# Altium schematic sheet schematic.SchDoc
size A2; SheetNumber: 6; SheetTotal: 29
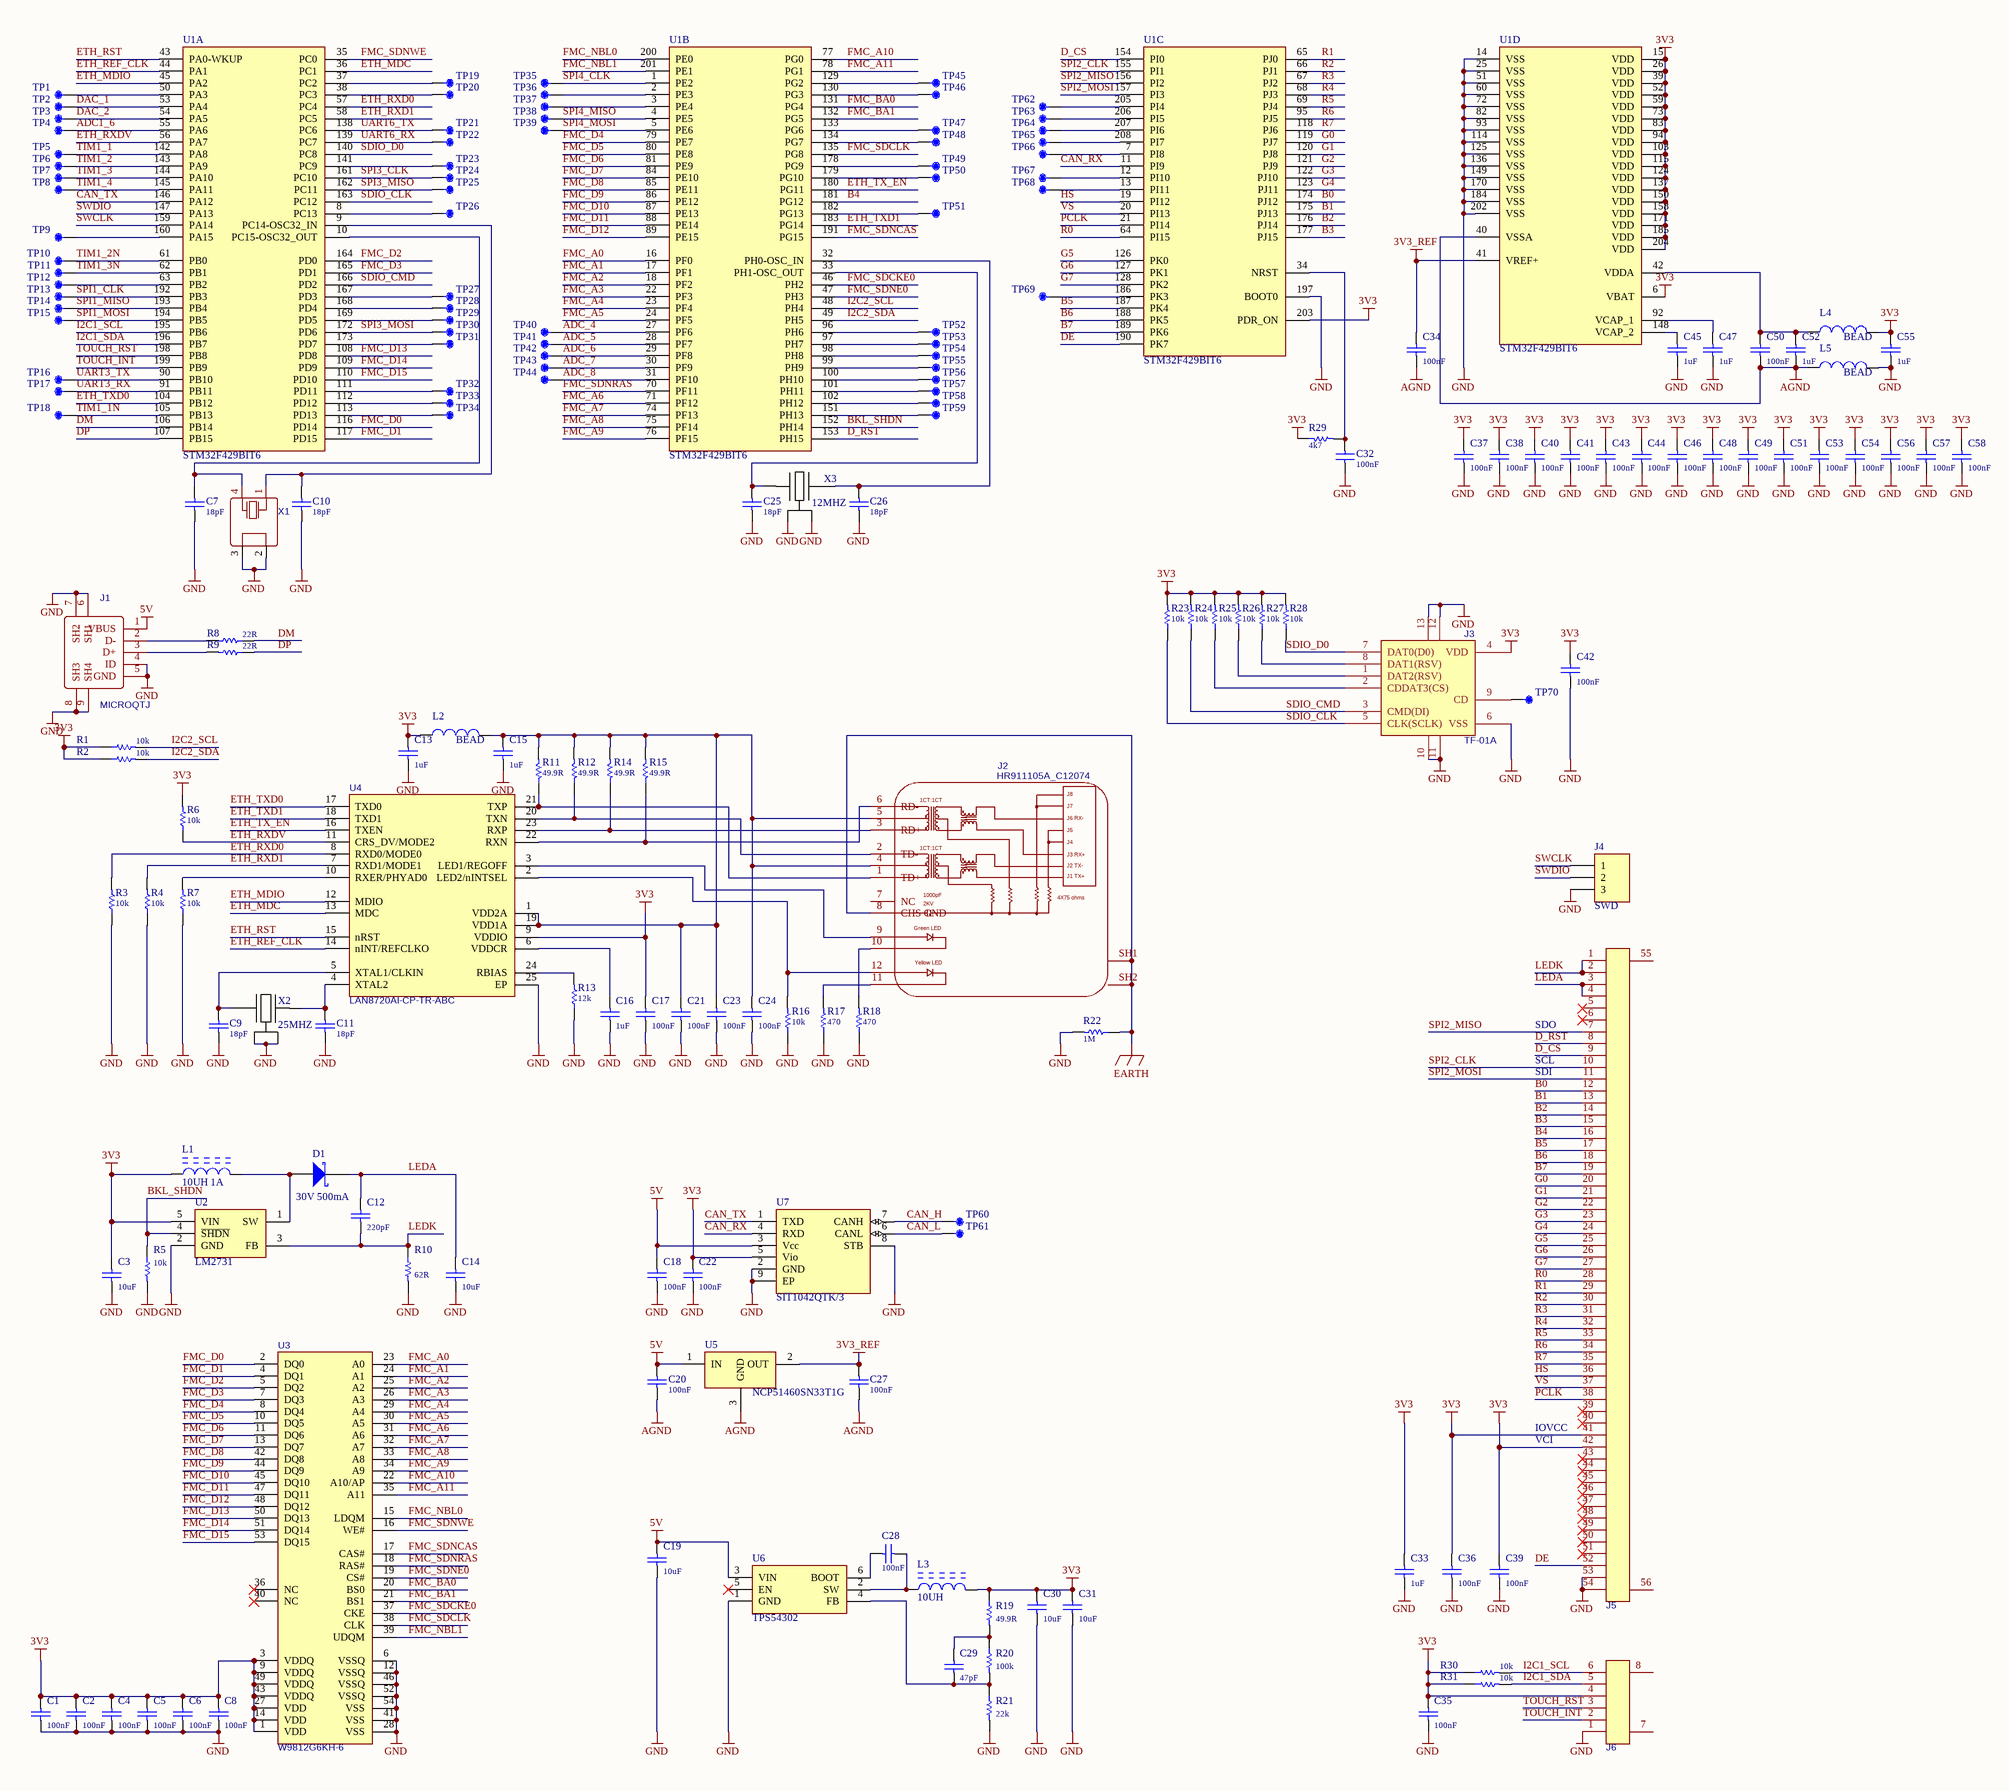
[diagram p0: schematic.SchDoc]

## Parts
C1  100nF  [C0402]
C2  100nF  [C0402]
C3  10uF  [C0603]
C4  100nF  [C0402]
C5  100nF  [C0402]
C6  100nF  [C0402]
C7  18pF  [C0402]
C8  100nF  [C0402]
C9  18pF  [C0402]
C10  18pF  [C0402]
C11  18pF  [C0402]
C12  220pF  [C0402]
C13  1uF  [C0603]
C14  10uF  [C1206]
C15  1uF  [C0603]
C16  1uF  [C0603]
C17  100nF  [C0402]
C18  100nF  [C0402]
C19  10uF  [C1206]
C20  100nF  [C0603]
C21  100nF  [C0402]
C22  100nF  [C0402]
C23  100nF  [C0402]
C24  100nF  [C0402]
C25  18pF  [C0402]
C26  18pF  [C0402]
C27  100nF  [C0603]
C28  100nF  [C0603]
C29  47pF  [C0603]
C30  10uF  [C1206]
C31  10uF  [C1206]
C32  100nF  [C0402]
C33  1uF  [C0603]
C34  100nF  [C0402]
C35  100nF  [C0402]
C36  100nF  [C0402]
C37  100nF  [C0402]
C38  100nF  [C0402]
C39  100nF  [C0402]
C40  100nF  [C0402]
C41  100nF  [C0402]
C42  100nF  [C0402]
C43  100nF  [C0402]
C44  100nF  [C0402]
C45  1uF  [C0603]
C46  100nF  [C0402]
C47  1uF  [C0603]
C48  100nF  [C0402]
C49  100nF  [C0402]
C50  100nF  [C0402]
C51  100nF  [C0402]
C52  1uF  [C0603]
C53  100nF  [C0402]
C54  100nF  [C0402]
C55  1uF  [C0603]
C56  100nF  [C0402]
C57  100nF  [C0402]
C58  100nF  [C0402]
D1  30V 500mA  [SOD123]
J1  MICROQTJ  [MICRO-USB-SMD_MICROQTJ]
J2  HR911105A_C12074  [RJ45-TH_HR911105A]
J3  TF-01A  [TF-SMD_TF-01A]
J4  SWD  [SWD]  (no BOM)
J5  KH-CL0.5-H2.0-54PIN  [FPC-SMD_KH-CL0.5-H2.0-54PIN]  (value not drawn)
J6  KH-CL0.5-H2.0-6PS  [FPC-SMD_KH-CL0.5-H2.0-6PS]  (value not drawn)
L1  10UH 1A  [IND_SDE0403A_4X4MM]
L2  BEAD  [L0603]
L3  10UH  [L2520]
L4  BEAD  [L0402]
L5  BEAD  [L0402]
R1  10k  [R0603]
R2  10k  [R0603]
R3  10k  [R0402]
R4  10k  [R0402]
R5  10k  [R0402]
R6  10k  [R0402]
R7  10k  [R0402]
R8  22R  [R0603]
R9  22R  [R0603]
R10  62R  [R0603]
R11  49.9R  [R0603]
R12  49.9R  [R0603]
R13  12k  [R0402]
R14  49.9R  [R0603]
R15  49.9R  [R0603]
R16  10k  [R0603]
R17  470  [R0603]
R18  470  [R0603]
R19  49.9R  [R0603]
R20  100k  [R0603]
R21  22k  [R0603]
R22  1M  [R1206]
R23  10k  [R0603]
R24  10k  [R0603]
R25  10k  [R0603]
R26  10k  [R0603]
R27  10k  [R0603]
R28  10k  [R0603]
R29  4k7  [R0402]
R30  10k  [R0603]
R31  10k  [R0603]
TP1  (no value)  [TP2030_SMD]  (no BOM)
TP2  (no value)  [TP2030_SMD]  (no BOM)
TP3  (no value)  [TP2030_SMD]  (no BOM)
TP4  (no value)  [TP2030_SMD]  (no BOM)
TP5  (no value)  [TP2030_SMD]  (no BOM)
TP6  (no value)  [TP2030_SMD]  (no BOM)
TP7  (no value)  [TP2030_SMD]  (no BOM)
TP8  (no value)  [TP2030_SMD]  (no BOM)
TP9  (no value)  [TP2030_SMD]  (no BOM)
TP10  (no value)  [TP2030_SMD]  (no BOM)
TP11  (no value)  [TP2030_SMD]  (no BOM)
TP12  (no value)  [TP2030_SMD]  (no BOM)
TP13  (no value)  [TP2030_SMD]  (no BOM)
TP14  (no value)  [TP2030_SMD]  (no BOM)
TP15  (no value)  [TP2030_SMD]  (no BOM)
TP16  (no value)  [TP2030_SMD]  (no BOM)
TP17  (no value)  [TP2030_SMD]  (no BOM)
TP18  (no value)  [TP2030_SMD]  (no BOM)
TP19  (no value)  [TP2030_SMD]  (no BOM)
TP20  (no value)  [TP2030_SMD]  (no BOM)
TP21  (no value)  [TP2030_SMD]  (no BOM)
TP22  (no value)  [TP2030_SMD]  (no BOM)
TP23  (no value)  [TP2030_SMD]  (no BOM)
TP24  (no value)  [TP2030_SMD]  (no BOM)
TP25  (no value)  [TP2030_SMD]  (no BOM)
TP26  (no value)  [TP2030_SMD]  (no BOM)
TP27  (no value)  [TP2030_SMD]  (no BOM)
TP28  (no value)  [TP2030_SMD]  (no BOM)
TP29  (no value)  [TP2030_SMD]  (no BOM)
TP30  (no value)  [TP2030_SMD]  (no BOM)
TP31  (no value)  [TP2030_SMD]  (no BOM)
TP32  (no value)  [TP2030_SMD]  (no BOM)
TP33  (no value)  [TP2030_SMD]  (no BOM)
TP34  (no value)  [TP2030_SMD]  (no BOM)
TP35  (no value)  [TP2030_SMD]  (no BOM)
TP36  (no value)  [TP2030_SMD]  (no BOM)
TP37  (no value)  [TP2030_SMD]  (no BOM)
TP38  (no value)  [TP2030_SMD]  (no BOM)
TP39  (no value)  [TP2030_SMD]  (no BOM)
TP40  (no value)  [TP2030_SMD]  (no BOM)
TP41  (no value)  [TP2030_SMD]  (no BOM)
TP42  (no value)  [TP2030_SMD]  (no BOM)
TP43  (no value)  [TP2030_SMD]  (no BOM)
TP44  (no value)  [TP2030_SMD]  (no BOM)
TP45  (no value)  [TP2030_SMD]  (no BOM)
TP46  (no value)  [TP2030_SMD]  (no BOM)
TP47  (no value)  [TP2030_SMD]  (no BOM)
TP48  (no value)  [TP2030_SMD]  (no BOM)
TP49  (no value)  [TP2030_SMD]  (no BOM)
TP50  (no value)  [TP2030_SMD]  (no BOM)
TP51  (no value)  [TP2030_SMD]  (no BOM)
TP52  (no value)  [TP2030_SMD]  (no BOM)
TP53  (no value)  [TP2030_SMD]  (no BOM)
TP54  (no value)  [TP2030_SMD]  (no BOM)
TP55  (no value)  [TP2030_SMD]  (no BOM)
TP56  (no value)  [TP2030_SMD]  (no BOM)
TP57  (no value)  [TP2030_SMD]  (no BOM)
TP58  (no value)  [TP2030_SMD]  (no BOM)
TP59  (no value)  [TP2030_SMD]  (no BOM)
TP60  (no value)  [TP2030_SMD]  (no BOM)
TP61  (no value)  [TP2030_SMD]  (no BOM)
TP62  (no value)  [TP2030_SMD]  (no BOM)
TP63  (no value)  [TP2030_SMD]  (no BOM)
TP64  (no value)  [TP2030_SMD]  (no BOM)
TP65  (no value)  [TP2030_SMD]  (no BOM)
TP66  (no value)  [TP2030_SMD]  (no BOM)
TP67  (no value)  [TP2030_SMD]  (no BOM)
TP68  (no value)  [TP2030_SMD]  (no BOM)
TP69  (no value)  [TP2030_SMD]  (no BOM)
TP70  (no value)  [TP2030_SMD]  (no BOM)
U1  STM32F429BIT6  [LQFP-208_L28.0-W28.0-P0.50-BL]  (parts A,B,C,D of 4)
U2  LM2731  [SOT-23-5]
U3  W9812G6KH-6  [TSOP-54_L22.2-W10.2-P0.80-LS11.8-BL]
U4  LAN8720AI-CP-TR-ABC  [QFN-24_L4.0-W4.0-P0.50-TL-EP2.5]
U5  NCP51460SN33T1G  [SOT-23]
U6  TPS54302  [SOT-23-6]
U7  SIT1042QTK/3  [DFN8_3X3_P065]
X1  32.768kHz  [MC-146]  (value not drawn)
X2  25MHZ  [CRYSTAL_3.2x2.5mm]
X3  12MHZ  [CRYSTAL_3.2x2.5mm]

## Nets
3V3: C1.2 C2.2 C3.2 C4.2 C5.2 C6.2 C8.2 C13.2 C17.2 C22.2 C30.2 C31.2 C33.2 C35.2 C36.2 C37.2 C38.2 C39.2 C40.2 C41.2 C42.2 C43.2 C44.2 C46.2 C48.2 C49.2 C51.2 C53.2 C54.2 C55.2 C56.2 C57.2 C58.2 J3.4(VDD) J5.41 J5.42 J6.4 L1.1 L2.2 L3.2 L4.1 R1.1 R2.1 R6.2 R19.1 R23.2 R24.2 R25.2 R26.2 R27.2 R28.2 R29.1 R30.1 R31.1 U1.6(VBAT) U1.15(VDD) U1.26(VDD) U1.39(VDD) U1.52(VDD) U1.59(VDD) U1.73(VDD) U1.83(VDD) U1.94(VDD) U1.103(VDD) U1.115(VDD) U1.124(VDD) U1.137(VDD) U1.150(VDD) U1.158(VDD) U1.171(VDD) U1.185(VDD) U1.203(PDR_ON) U1.204(VDD) U2.5(VIN) U3.1(VDD) U3.3(VDDQ) U3.9(VDDQ) U3.14(VDD) U3.27(VDD) U3.43(VDDQ) U3.49(VDDQ) U4.9(VDDIO) U7.5(Vio)
3V3_REF: C27.2 C34.2 U1.41(VREF+) U5.2(OUT)
5V: C18.2 C19.2 C20.2 J1.1(VBUS) U5.1(IN) U6.3(VIN) U7.3(Vcc)
AGND: C20.1 C27.1 C34.1 C50.1 C52.1 L5.2 U1.40(VSSA) U5.3(GND)
EARTH: J2.8(CHS_GND) J2.SH1 J2.SH2 R22.1
GND: C1.1 C2.1 C3.1 C4.1 C5.1 C6.1 C7.1 C8.1 C9.1 C10.1 C11.1 C13.1 C14.1 C15.1 C16.1 C17.1 C18.1 C19.1 C21.1 C22.1 C23.1 C24.1 C25.1 C26.1 C30.1 C31.1 C32.1 C33.1 C35.1 C36.1 C37.1 C38.1 C39.1 C40.1 C41.1 C42.1 C43.1 C44.1 C45.1 C46.1 C47.1 C48.1 C49.1 C51.1 C53.1 C54.1 C55.1 C56.1 C57.1 C58.1 J1.4(ID) J1.5(GND) J1.6(SH1) J1.7(SH2) J1.8(SH3) J1.9(SH4) J3.6(VSS) J3.10(GND) J3.11(GND) J3.12(GND) J3.13(GND) J4.3 J5.53 J5.54 J6.1 L5.1 R3.1 R4.1 R5.2 R7.1 R10.2 R13.1 R16.1 R17.1 R18.1 R21.2 R22.2 U1.14(VSS) U1.25(VSS) U1.51(VSS) U1.60(VSS) U1.72(VSS) U1.82(VSS) U1.93(VSS) U1.114(VSS) U1.125(VSS) U1.136(VSS) U1.149(VSS) U1.170(VSS) U1.184(VSS) U1.197(BOOT0) U1.202(VSS) U2.2(GND) U3.6(VSSQ) U3.12(VSSQ) U3.28(VSS) U3.41(VSS) U3.46(VSSQ) U3.52(VSSQ) U3.54(VSS) U4.25(EP) U6.1(GND) U7.2(GND) U7.8(STB) U7.9(EP) X1.2 X1.3 X2.2(GND) X2.4(GND) X3.2(GND) X3.4(GND)
ADC1_6: TP4.1 U1.55(PA6)
ADC_4: TP40.1 U1.27(PF6)
ADC_5: TP41.1 U1.28(PF7)
ADC_6: TP42.1 U1.29(PF8)
ADC_7: TP43.1 U1.30(PF9)
ADC_8: TP44.1 U1.31(PF10)
B0: J5.12 U1.174(PJ12)
B1: J5.13 U1.175(PJ13)
B2: J5.14 U1.176(PJ14)
B3: J5.15 U1.177(PJ15)
B4: J5.16 U1.181(PG12)
B5: J5.17 U1.187(PK4)
B6: J5.18 U1.188(PK5)
B7: J5.19 U1.189(PK6)
BKL_SHDN: R5.1 U1.152(PH14) U2.4(~{SHDN})
CAN_H: TP60.1 U7.7(CANH)
CAN_L: TP61.1 U7.6(CANL)
CAN_RX: U1.11(PI9) U7.4(RXD)
CAN_TX: U1.146(PA12) U7.1(TXD)
D_CS: J5.9 U1.154(PI0)
D_RST: J5.8 U1.153(PH15)
DAC_1: TP2.1 U1.53(PA4)
DAC_2: TP3.1 U1.54(PA5)
DE: J5.52 U1.190(PK7)
DM: R8.1 U1.106(PB14)
DP: R9.1 U1.107(PB15)
ETH_MDC: U1.36(PC1) U4.13(MDC)
ETH_MDIO: U1.45(PA2) U4.12(MDIO)
ETH_REF_CLK: U1.44(PA1) U4.14(nINT/REFCLKO)
ETH_RST: U1.43(PA0-WKUP) U4.15(nRST)
ETH_RXD0: R3.2 U1.57(PC4) U4.8(RXD0/MODE0)
ETH_RXD1: R4.2 U1.58(PC5) U4.7(RXD1/MODE1)
ETH_RXDV: R6.1 U1.56(PA7) U4.11(CRS_DV/MODE2)
ETH_TX_EN: U1.180(PG11) U4.16(TXEN)
ETH_TXD0: U1.104(PB12) U4.17(TXD0)
ETH_TXD1: U1.183(PG14) U4.18(TXD1)
FMC_A0: U1.16(PF0) U3.23(A0)
FMC_A1: U1.17(PF1) U3.24(A1)
FMC_A2: U1.18(PF2) U3.25(A2)
FMC_A3: U1.22(PF3) U3.26(A3)
FMC_A4: U1.23(PF4) U3.29(A4)
FMC_A5: U1.24(PF5) U3.30(A5)
FMC_A6: U1.71(PF12) U3.31(A6)
FMC_A7: U1.74(PF13) U3.32(A7)
FMC_A8: U1.75(PF14) U3.33(A8)
FMC_A9: U1.76(PF15) U3.34(A9)
FMC_A10: U1.77(PG0) U3.22(A10/AP)
FMC_A11: U1.78(PG1) U3.35(A11)
FMC_BA0: U1.131(PG4) U3.20(BS0)
FMC_BA1: U1.132(PG5) U3.21(BS1)
FMC_D0: U1.116(PD14) U3.2(DQ0)
FMC_D1: U1.117(PD15) U3.4(DQ1)
FMC_D2: U1.164(PD0) U3.5(DQ2)
FMC_D3: U1.165(PD1) U3.7(DQ3)
FMC_D4: U1.79(PE7) U3.8(DQ4)
FMC_D5: U1.80(PE8) U3.10(DQ5)
FMC_D6: U1.81(PE9) U3.11(DQ6)
FMC_D7: U1.84(PE10) U3.13(DQ7)
FMC_D8: U1.85(PE11) U3.42(DQ8)
FMC_D9: U1.86(PE12) U3.44(DQ9)
FMC_D10: U1.87(PE13) U3.45(DQ10)
FMC_D11: U1.88(PE14) U3.47(DQ11)
FMC_D12: U1.89(PE15) U3.48(DQ12)
FMC_D13: U1.108(PD8) U3.50(DQ13)
FMC_D14: U1.109(PD9) U3.51(DQ14)
FMC_D15: U1.110(PD10) U3.53(DQ15)
FMC_NBL0: U1.200(PE0) U3.15(LDQM)
FMC_NBL1: U1.201(PE1) U3.39(UDQM)
FMC_SDCKE0: U1.46(PH2) U3.37(CKE)
FMC_SDCLK: U1.135(PG8) U3.38(CLK)
FMC_SDNCAS: U1.191(PG15) U3.17(CAS#)
FMC_SDNE0: U1.47(PH3) U3.19(CS#)
FMC_SDNRAS: U1.70(PF11) U3.18(RAS#)
FMC_SDNWE: U1.35(PC0) U3.16(WE#)
G0: J5.20 U1.119(PJ7)
G1: J5.21 U1.120(PJ8)
G2: J5.22 U1.121(PJ9)
G3: J5.23 U1.122(PJ10)
G4: J5.24 U1.123(PJ11)
G5: J5.25 U1.126(PK0)
G6: J5.26 U1.127(PK1)
G7: J5.27 U1.128(PK2)
HS: J5.36 U1.19(PI12)
I2C1_SCL: J6.6 R30.2 U1.195(PB6)
I2C1_SDA: J6.5 R31.2 U1.196(PB7)
I2C2_SCL: R1.2 U1.48(PH4)
I2C2_SDA: R2.2 U1.49(PH5)
LEDA: C12.2 C14.2 D1.2(K) J5.3 J5.4
LEDK: C12.1 J5.1 J5.2 R10.1 U2.3(FB)
PCLK: J5.38 U1.21(PI14)
R0: J5.28 U1.64(PI15)
R1: J5.29 U1.65(PJ0)
R2: J5.30 U1.66(PJ1)
R3: J5.31 U1.67(PJ2)
R4: J5.32 U1.68(PJ3)
R5: J5.33 U1.69(PJ4)
R6: J5.34 U1.95(PJ5)
R7: J5.35 U1.118(PJ6)
SDIO_CLK: J3.5(CLK(SCLK)) R23.1 U1.163(PC12)
SDIO_CMD: J3.3(CMD(DI)) R24.1 U1.166(PD2)
SDIO_D0: J3.7(DAT0(D0)) R28.1 U1.140(PC8)
SPI1_CLK: TP13.1 U1.192(PB3)
SPI1_MISO: TP14.1 U1.193(PB4)
SPI1_MOSI: TP15.1 U1.194(PB5)
SPI2_CLK: J5.10 U1.155(PI1)
SPI2_MISO: J5.7 U1.156(PI2)
SPI2_MOSI: J5.11 U1.157(PI3)
SPI3_CLK: TP24.1 U1.161(PC10)
SPI3_MISO: TP25.1 U1.162(PC11)
SPI3_MOSI: TP30.1 U1.172(PD6)
SPI4_CLK: TP35.1 U1.1(PE2)
SPI4_MISO: TP38.1 U1.4(PE5)
SPI4_MOSI: TP39.1 U1.5(PE6)
SWCLK: J4.1 U1.159(PA14)
SWDIO: J4.2 U1.147(PA13)
TIM1_1: TP5.1 U1.142(PA8)
TIM1_1N: TP18.1 U1.105(PB13)
TIM1_2: TP6.1 U1.143(PA9)
TIM1_2N: TP10.1 U1.61(PB0)
TIM1_3: TP7.1 U1.144(PA10)
TIM1_3N: TP11.1 U1.62(PB1)
TIM1_4: TP8.1 U1.145(PA11)
TOUCH_INT: J6.2 U1.199(PB9)
TOUCH_RST: J6.3 U1.198(PB8)
UART3_RX: TP17.1 U1.91(PB11)
UART3_TX: TP16.1 U1.90(PB10)
UART6_RX: TP22.1 U1.139(PC7)
UART6_TX: TP21.1 U1.138(PC6)
VS: J5.37 U1.20(PI13)
NetC7_2: C7.2 U1.10(PC15-OSC32_OUT) X1.4(OSC2)
NetC9_2: C9.2 U4.5(XTAL1/CLKIN) X2.3(X2)
NetC10_2: C10.2 U1.9(PC14-OSC32_IN) X1.1(OSC1)
NetC11_2: C11.2 U4.4(XTAL2) X2.1(X1)
NetC15_2: C15.2 C21.2 C23.2 C24.2 J2.4 J2.5 L2.1 R11.2 R12.2 R14.2 R15.2 U4.1(VDD2A) U4.19(VDD1A)
NetC16_2: C16.2 U4.6(VDDCR)
NetC25_2: C25.2 U1.33(PH1-OSC_OUT) X3.1(X1)
NetC26_2: C26.2 U1.32(PH0-OSC_IN) X3.3(X2)
NetC28_1: C28.1 U6.6(BOOT)
NetC28_2: C28.2 L3.1 U6.2(SW)
NetC29_1: C29.1 R20.2 R21.1 U6.4(FB)
NetC29_2: C29.2 R19.2 R20.1
NetC32_2: C32.2 R29.2 U1.34(NRST)
NetC45_2: C45.2 U1.148(VCAP_2)
NetC47_2: C47.2 U1.92(VCAP_1)
NetC50_2: C50.2 C52.2 L4.2 U1.42(VDDA)
NetD1_1: D1.1(A) L1.2 U2.1(SW)
NetJ1_2: J1.2(D-) R8.2
NetJ1_3: J1.3(D+) R9.2
NetJ2_1: J2.1(TD+) R11.1 U4.21(TXP)
NetJ2_2: J2.2(TD-) R12.1 U4.20(TXN)
NetJ2_3: J2.3(RD+) R14.1 U4.23(RXP)
NetJ2_6: J2.6(RD-) R15.1 U4.22(RXN)
NetJ2_9: J2.9 U4.3(LED1/REGOFF)
NetJ2_10: J2.10 R18.2
NetJ2_11: J2.11 R17.2
NetJ2_12: J2.12 R16.2 U4.2(LED2/nINTSEL)
NetJ3_1: J3.1(DAT2(RSV)) R26.1
NetJ3_2: J3.2(CDDAT3(CS)) R25.1
NetJ3_8: J3.8(DAT1(RSV)) R27.1
NetJ3_9: J3.9(CD) TP70.1
NetR7_2: R7.2 U4.10(RXER/PHYAD0)
NetR13_2: R13.2 U4.24(RBIAS)
NetTP1_1: TP1.1 U1.50(PA3)
NetTP9_1: TP9.1 U1.160(PA15)
NetTP12_1: TP12.1 U1.63(PB2)
NetTP19_1: TP19.1 U1.37(PC2)
NetTP20_1: TP20.1 U1.38(PC3)
NetTP23_1: TP23.1 U1.141(PC9)
NetTP26_1: TP26.1 U1.8(PC13)
NetTP27_1: TP27.1 U1.167(PD3)
NetTP28_1: TP28.1 U1.168(PD4)
NetTP29_1: TP29.1 U1.169(PD5)
NetTP31_1: TP31.1 U1.173(PD7)
NetTP32_1: TP32.1 U1.111(PD11)
NetTP33_1: TP33.1 U1.112(PD12)
NetTP34_1: TP34.1 U1.113(PD13)
NetTP36_1: TP36.1 U1.2(PE3)
NetTP37_1: TP37.1 U1.3(PE4)
NetTP45_1: TP45.1 U1.129(PG2)
NetTP46_1: TP46.1 U1.130(PG3)
NetTP47_1: TP47.1 U1.133(PG6)
NetTP48_1: TP48.1 U1.134(PG7)
NetTP49_1: TP49.1 U1.178(PG9)
NetTP50_1: TP50.1 U1.179(PG10)
NetTP51_1: TP51.1 U1.182(PG13)
NetTP52_1: TP52.1 U1.96(PH6)
NetTP53_1: TP53.1 U1.97(PH7)
NetTP54_1: TP54.1 U1.98(PH8)
NetTP55_1: TP55.1 U1.99(PH9)
NetTP56_1: TP56.1 U1.100(PH10)
NetTP57_1: TP57.1 U1.101(PH11)
NetTP58_1: TP58.1 U1.102(PH12)
NetTP59_1: TP59.1 U1.151(PH13)
NetTP62_1: TP62.1 U1.205(PI4)
NetTP63_1: TP63.1 U1.206(PI5)
NetTP64_1: TP64.1 U1.207(PI6)
NetTP65_1: TP65.1 U1.208(PI7)
NetTP66_1: TP66.1 U1.7(PI8)
NetTP67_1: TP67.1 U1.12(PI10)
NetTP68_1: TP68.1 U1.13(PI11)
NetTP69_1: TP69.1 U1.186(PK3)

Not connected (* = marked no-connect by the designer): J2 7(NC); J5 5* 6* 39* 40* 43* 44* 45* 46* 47* 48* 49* 50* 51* 55 56; J6 7 8; U3 36(NC)* 40(NC)*; U6 5(EN)*

## Notes on the sheet
- SCL
- SDI
- SDO
- (near J5) IOVCC
- VCI
- (in symbol HR911105A_C12074) J8; 1CT:1CT; J7; J6 RX-; J5; J4; J3 RX+; J2 TX-; J1 TX+; 1000pF; 4X75 ohms; 2KV; Green LED; Yellow LED

## Library data of the parts
C1 C2 C4-C6 C8 C17 C18 C21-C24 C32 C34-C44 C46 C48-C51 C53 C54 C56-C58 = CAP: 100nF 0402
C3 = CAP_0603_10UF 25V: 10uF 0603
C7 C9-C11 C25 C26 = CAP: 18pF 0402
C12 = CAP_0402_220pF 25V: 220pF 0402
C13 C15 C16 C33 C45 C47 C52 C55 = CAP: 1uF 0603
C14 = CAP_0603_10UF 25V: 10uF 1206
C19 C30 C31 = CAP: 10uF 1206
C20 = CAP: 100nf 0603
C27 C28 = CAP: 100nF 0603
C29 = CAP: 47pF 0603
D1 = MBR0530T1G: 1N4148WS
J4 = Header 3
L1 = SRN3015-100M: VLS252012HBX-100M-1
L2 L4 L5 = BLM18AG601SN1D: BEAD 0402
L3 = SRN3015-100M: CYA0630-10UH
R1 R2 R16 R23-R28 R30 R31 = RES_0402_1K5-1%: 10k 0603
R3-R7 = RES_0402_1K5-1%: 10k 0402
R8 R9 = RES: 22R 0603
R10 = RES_0402_1K5-1%: 62R 0603
R11 R12 R14 R15 = RES: 49.9R 0603
R13 = RES: 12k 0402
R17 R18 = RES_0402_1K5-1%: 470R 0603
R19 = R0201: 49.9R 0603
R20 = RES: 100k 0603
R21 = RES: 22k 0603
R22 = RES_0402_1K5-1%: 1M 0603
R29 = RES: 4k7 0402
TP1-TP70 = TP_Dup1
U2 = LM27313XMFX: IC REG BOOST ADJ 800MA SOT23-5
U6 = LM27313XMFX: TPS54302DDCR
U7 = LTC2875
X2 = CRYSTAL 12MHZ 3.20mm x 2.50mm: X322525MOB4SI
X3 = CRYSTAL 12MHZ 3.20mm x 2.50mm: X322512MOB4SI